# Altium project PCB_Project1.PrjPCB
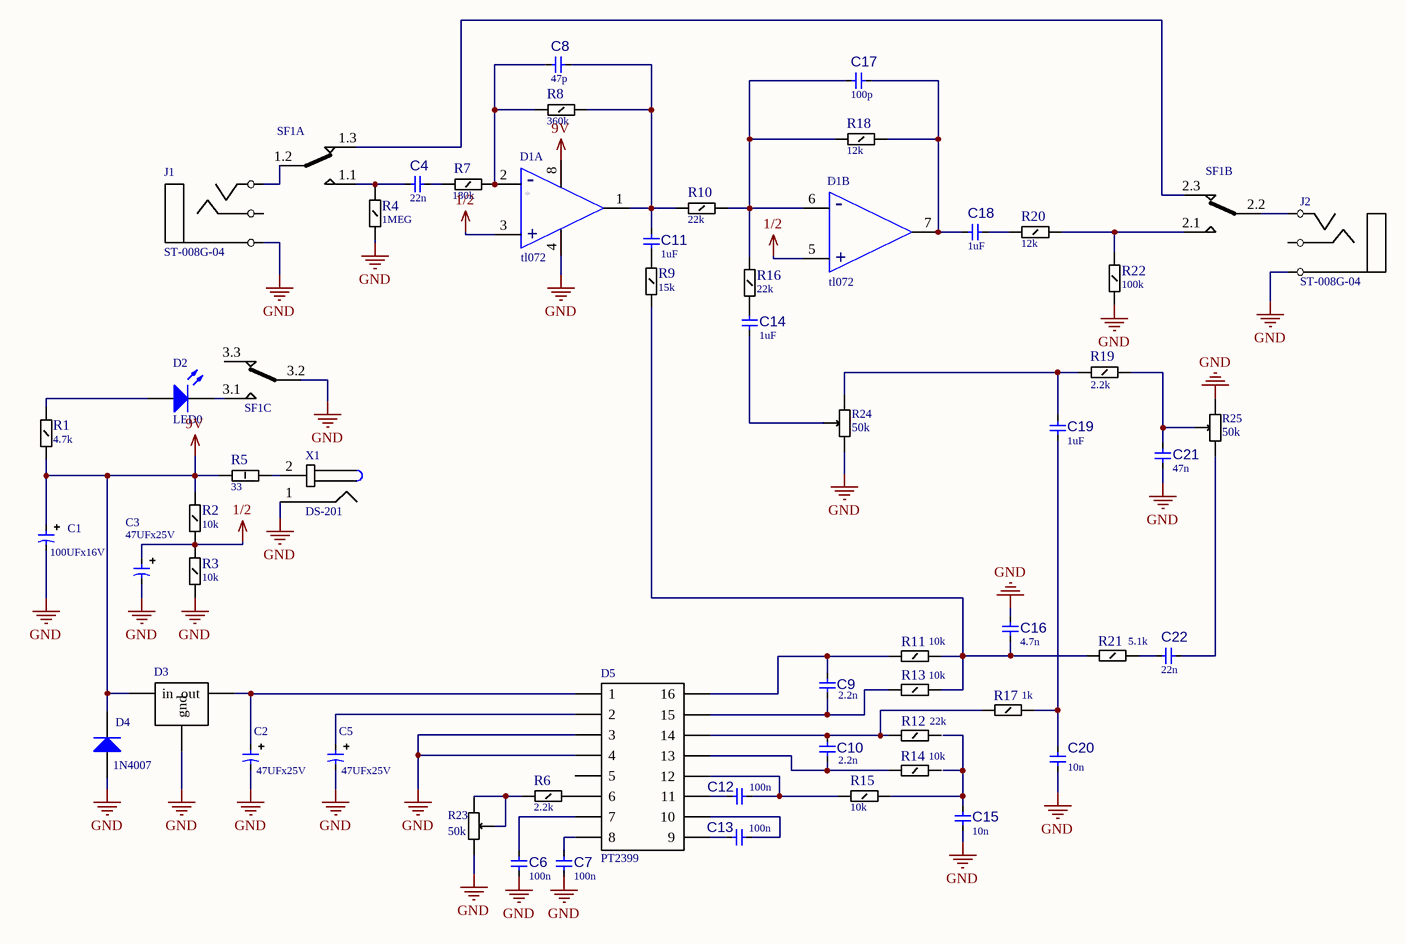
[diagram p0: Sheet1.SchDoc]
1 sheet, 56 parts. Net scope: global (net labels, ports and power ports of the same name join across sheets).
Board file: PCB1.PcbDoc

## Sheet Sheet1.SchDoc
size 420 x 297 mm; Scale: 1:1; DocumentType: Схема электрическая принципиальная; FirstReferrence: АБВГ.123456.001

### Parts
C1  value 100UFx16V  [C12x5]  (hidden comment: C15x8)
C2  value 47UFx25V  [B41828_D5]  (hidden comment: C15x8)
C3  value 47UFx25V  [B41828_D5]  (hidden comment: C15x8)
C4  value 22n  [B32529C 3222]  (hidden comment: C0603)
C5  value 47UFx25V  [B41828_D5]  (hidden comment: C15x8)
C6  value 100n  [B32529C 3222]  (hidden comment: C0603)
C7  value 100n  [B32529C 3222]  (hidden comment: C0603)
C8  value 47p  [C1206]  (hidden comment: C1206)
C9  2.2n  [B32529C 3222]
C10  2.2n  [B32529C 3222]
C11  1uF  [B32529_C0105]
C12  value 100n  [B32529C 3222]  (hidden comment: C0603)
C13  value 100n  [B32529C 3222]  (hidden comment: C0603)
C14  1uF  [B32529_C0105]
C15  10n  [B32529C 3222]
C16  4.7n  [B32529C 3222]
C17  value 100p  [C1206]  (hidden comment: C1206)
C18  1uF  [B32529_C0105]
C19  1uF  [B32529_C0105]
C20  10n  [B32529C 3222]
C21  47n  [B32529C 3222]
C22  value 22n  [B32529C 3222]  (hidden comment: C0603)
D1  tl072  [SO8_L]  (parts A,B of 2)
D2  LED0  [LED-0]
D3  L7805  [D2PACK]  (value not drawn)
D4  1N4007  [DO-41]
D5  PT2399  [DIP-16]
J1  ST-008G-04  [ST-008G-04]
J2  ST-008G-04  [ST-008G-04]
R1  value 4.7k  [R1206]  (hidden comment: R1206-0,25 W)
R2  value 10k  [R1206]  (hidden comment: R1206-0,25 W)
R3  value 10k  [R1206]  (hidden comment: R1206-0,25 W)
R4  value 1MEG  [R1206]  (hidden comment: R1206-0,25 W)
R5  value 33  [R2512]  (hidden comment: R2512-1 W)
R6  value 2.2k  [R1206]  (hidden comment: R1206-0,25 W)
R7  value 180k  [R1206]  (hidden comment: R1206-0,25 W)
R8  value 360k  [R1206]  (hidden comment: R1206-0,25 W)
R9  value 15k  [R1206]  (hidden comment: R1206-0,25 W)
R10  value 22k  [R1206]  (hidden comment: R1206-0,25 W)
R11  value 10k  [R1206]  (hidden comment: R1206-0,25 W)
R12  value 22k  [R1206]  (hidden comment: R1206-0,25 W)
R13  value 10k  [R1206]  (hidden comment: R1206-0,25 W)
R14  value 10k  [R1206]  (hidden comment: R1206-0,25 W)
R15  value 10k  [R1206]  (hidden comment: R1206-0,25 W)
R16  value 22k  [R1206]  (hidden comment: R1206-0,25 W)
R17  value 1k  [R1206]  (hidden comment: R1206-0,25 W)
R18  value 12k  [R1206]  (hidden comment: R1206-0,25 W)
R19  value 2.2k  [R1206]  (hidden comment: R1206-0,25 W)
R20  value 12k  [R1206]  (hidden comment: R1206-0,25 W)
R21  value 5.1k  [R1206]  (hidden comment: R1206-0,25 W)
R22  value 100k  [R1206]  (hidden comment: R1206-0,25 W)
R23  50k  [16K1]
R24  50k  [16K1]
R25  50k  [16K1]
SF1  SF-17020F-0302-21R-L  [SF-17020F-0302-21R-L]  (value not drawn)  (parts A,B,C of 3)
X1  DS-201  [DS-201]

### Nets
1/2: C3.1 D1.3 D1.5 R2.1 R3.2
9V: C1.1 D1.8 D3.1(in) D4.2(K) R1.1 R2.2 R5.1
GND: C1.2 C2.2 C3.2 C5.2 C6.1 C7.1 C15.1 C16.2 C20.1 C21.1 D1.4 D3.0(gnd) D4.1(A) D5.3 D5.4 J1.3 J2.3 R3.1 R4.1 R22.1 R23.1 R24.3 R25.1 SF1.3.2 X1.1
NetC2_1: C2.1 D3.2(out) D5.1
NetC4_1: C4.1 R4.2 SF1.1.1
NetC4_2: C4.2 R7.1
NetC5_1: C5.1 D5.2
NetC6_2: C6.2 D5.7
NetC7_2: C7.2 D5.8
NetC8_1: C8.1 D1.2 R7.2 R8.1
NetC8_2: C8.2 C11.2 D1.1 R8.2 R10.1
NetC9_1: C9.1 D5.16 R11.1
NetC9_2: C9.2 D5.15 R13.1
NetC10_1: C10.1 D5.14 R12.1 R17.1
NetC10_2: C10.2 D5.13 R14.1
NetC11_1: C11.1 R9.2
NetC12_1: C12.1 D5.12 R15.1
NetC12_2: C12.2 D5.11
NetC13_1: C13.1 D5.10
NetC13_2: C13.2 D5.9
NetC14_1: C14.1 R24.2
NetC14_2: C14.2 R16.1
NetC15_2: C15.2 R15.2
NetC16_1: C16.1 R9.1 R11.2 R13.2 R21.1
NetC17_1: C17.1 D1.6 R10.2 R16.2 R18.1
NetC17_2: C17.2 C18.2 D1.7 R18.2
NetC18_1: C18.1 R20.1
NetC19_1: C19.1 C20.2 R17.2
NetC19_2: C19.2 R19.1 R24.1
NetC21_2: C21.2 R19.2 R25.2
NetC22_1: C22.1 R21.2
NetC22_2: C22.2 R25.3
NetD2_1: D2.1(A) R1.2
NetD2_2: D2.2(K) SF1.3.1
NetD5_6: D5.6 R6.2
NetJ1_2: J1.2 SF1.1.2
NetJ2_2: J2.2 SF1.2.2
NetR5_2: R5.2 X1.2
NetR6_1: R6.1 R23.2 R23.3
NetR20_2: R20.2 R22.2 SF1.2.1
NetSF1_1.3: SF1.1.3 SF1.2.3

Not connected (* = marked no-connect by the designer): D5 5; J1 1; J2 1; R12 2; R14 2; SF1 3.3(1.3)

### Notes on the sheet
- Перв. примен.
- Справ. №
- Подп. и дата
- Инв. № дубл.
- Взам. инв. №
- Разраб.
- Изм.
- Лист
- № докум.
- Подп.
- Дата
- Лит.
- Масса
- Масштаб
- Пров.
- Т.контр.
- Листов
- Инв. № подл.
- Утв.
- Н.контр.
- 2.106-A3
- Копировал
- Формат А3
- (in symbol tl072, part A) -; +
- (in symbol tl072, part B) -; +

### Library data of the parts
C1 = Condensator C12x8: TitAD: Конденсатор; Part Number: Condensator C12x8
C2 C3 C5 = Condensator B41851: Manufacturer: Epcos; TitAD: Конденсатор; Power/Voltage: 25; Part Number: Condensator B41851
C4 C22 = Condensator C22n: ManufacturerPartNumber: B32529C1223J000; TitAD: Конденсатор; Part Number: Condensator C22n
C6 C7 C12 C13 = Condensator C100n: Manufacturer: Epcos; ManufacturerPartNumber: B32529C1223J000; TitAD: Конденсатор; Power/Voltage: 63; Part Number: Condensator C100n
C8 C17 = Condensator 1206 100: TitAD: Конденсатор; Part Number: Condensator 1206 100
C9 C10 = Condensator C2.2n: Manufacturer: Китай; ManufacturerPartNumber: К73-17; TitAD: Конденсатор; Power/Voltage: 630; Value: 2.2n; Part Number: Condensator C2.2n
C11 C14 C18 C19 = Condensator 1u: Manufacturer: Epcos; ManufacturerPartNumber: B32529C0105K000; TitAD: Конденсатор; Power/Voltage: 63; Value: 1uF; Part Number: Condensator 1u
C15 C20 = Condensator C10n: TitAD: Конденсатор; Value: 10n; Part Number: Condensator C10n
C16 = Condensator C4.7n: Manufacturer: Китай; ManufacturerPartNumber: К73-17; TitAD: Конденсатор; Power/Voltage: 250; Value: 4.7n; Part Number: Condensator C4.7n
C21 = Condensator C47n: Manufacturer: Epcos; ManufacturerPartNumber: B32529C1473J000; TitAD: Конденсатор; Power/Voltage: 63; Value: 47n; Part Number: Condensator C47n
D1 = tl072: TitAD: Микросхема; Part Number: tl072; Корпус: SO8_L
D2 = LED0: Typical INFRARED GaAs LED; Published: 8-Jun-2000; LatestRevisionDate: 08-Jul-2005; LatestRevisionNote: Mech Layer 1 removed.; PackageReference: LED-0; Publisher: Altium Limited; PackageDescription: LED; 2 Leads
D3 = L7805: ManufacturerPartNumber: L7805ABD2T-TR; TitAD: Микросхема; Part Number: L7805; Корпус: D2PACK
D4 = Diode 1N4007: 1 Amp General Purpose Rectifier; Published: 8-Jun-2000; LatestRevisionDate: 17-Jul-2002; LatestRevisionNote: Re-released for DXP Platform.; DatasheetVersion: 1998; PackageVersion: Aug-1999; PackageReference: DO-41; Publisher: Altium Limited; PackageDescription: Diode, Axial; Body 5.2 x 2.7 mm (LxDia. max), Lead Dia. 0.86 mm (max); Code_JEDEC: DO-204-AL; ComponentLink1Description: Manufacturer Link; ComponentLink1URL: http://www.fairchildsemi.com/; ComponentLink2Description: Datasheet; ComponentLink2URL: http://www.fairchildsemi.com/ds/1N%2F1N4001.pdf
D5 = PT2399: Manufacturer: Princeton Technology; Корпус: PID16; TitAD: Микросхема; Part Number: PT2399
J1 J2 = ST-008G-04: TitAD: Разъем; Part Number: ST-008G-04
R1-R3 = Resistor 1206 1.5k: TitAD: Резистор; Part Number: Resistor 1206 1.5k; Корпус: R1206
R4 R7-R10 R16 R18-R20 R22 = Resistor 1206 300: TitAD: Резистор; Part Number: Resistor 1206 300; Корпус: R1206
R5 = Resistor 2506 33: TitAD: Резистор; Part Number: Resistor 2506 33; Корпус: R2512
R6 R11-R15 R17 R21 = Resistor 1206 10k: TitAD: Резистор; Part Number: Resistor 1206 10k; Корпус: R1206
R23-R25 = Resistor 16K1: TitAD: Резистор; Part Number: Resistor 16K1; Value: 50k; Корпус: 16K1
SF1 = SF-17020F: TitAD: Разъем; Part Number: SF-17020F
X1 = DS-201: TitAD: Разъем; Part Number: DS-201